# Altium schematic sheet RS485.SchDoc
size A4; SheetNumber: 1; SheetTotal: 14
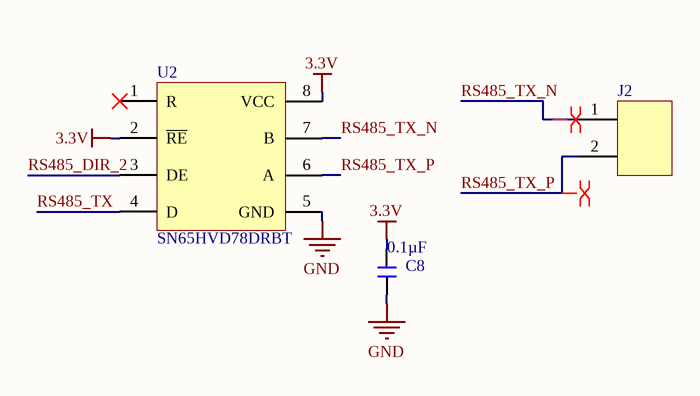
[diagram p0: RS485.SchDoc]

## Parts
C8  value 0.1µF  [402 capacitor - duplicate]  (hidden comment: 0402 capacitor)
J2  2 POS  [0901362102]  (value not drawn)
U2  SN65HVD78DRBT

## Nets
3.3V: C8.2 U2.2(~{RE}) U2.8(VCC)
GND: C8.1 U2.5(GND)
RS485_DIR_2: U2.3(DE)
RS485_TX: U2.4(D)
RS485_TX_N: J2.1 U2.7(B)
RS485_TX_P: J2.2 U2.6(A)

Not connected (* = marked no-connect by the designer): U2 1(R)*

## Layout directives
differential pair; net class 485_TX_N; differential pair class DIF_100: RS485_TX_N, RS485_TX_P

## Library data of the parts
C8 = CON SMD 402: MPN: CL05A104KA5NNNC; Package: 0402
J2 = 0901362102: CONN HEADER R/A 2POS 2.54MM; MPN: 0901362102
U2 = SN65HVD78DRBT: IC TRANSCEIVER HALF 1/1 8SON (-7V +12V - 54 Ω); MPN: SN65HVD78DRBT